# EAGLE schematic video-max3000a (EAGLE 5.11)
DRAWN_BY: Alexios; PROJECT_NAME: CFT Mini-Computer; REVISION: Rev J; SHEET_DESCRIPTION: Bus Connectors; SIMULATION_FILENAME: N/A; URL: http://www.bedroomlan.org/cft

## Sheet 1 of 2
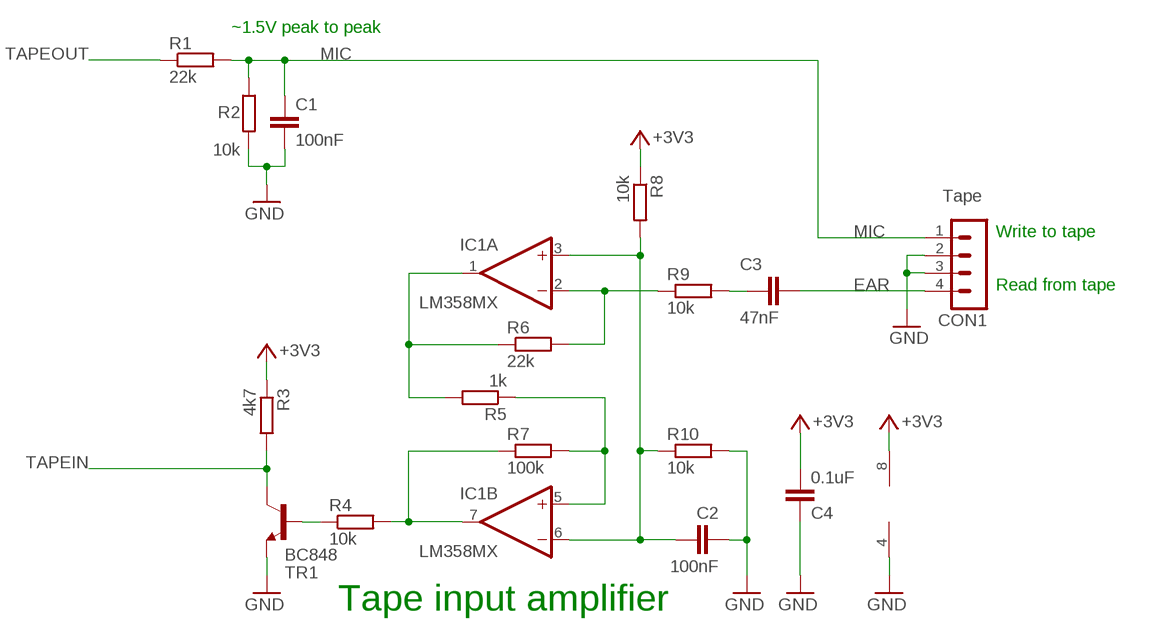
[diagram p0: schematic, sheet 1, part 1 of 3]
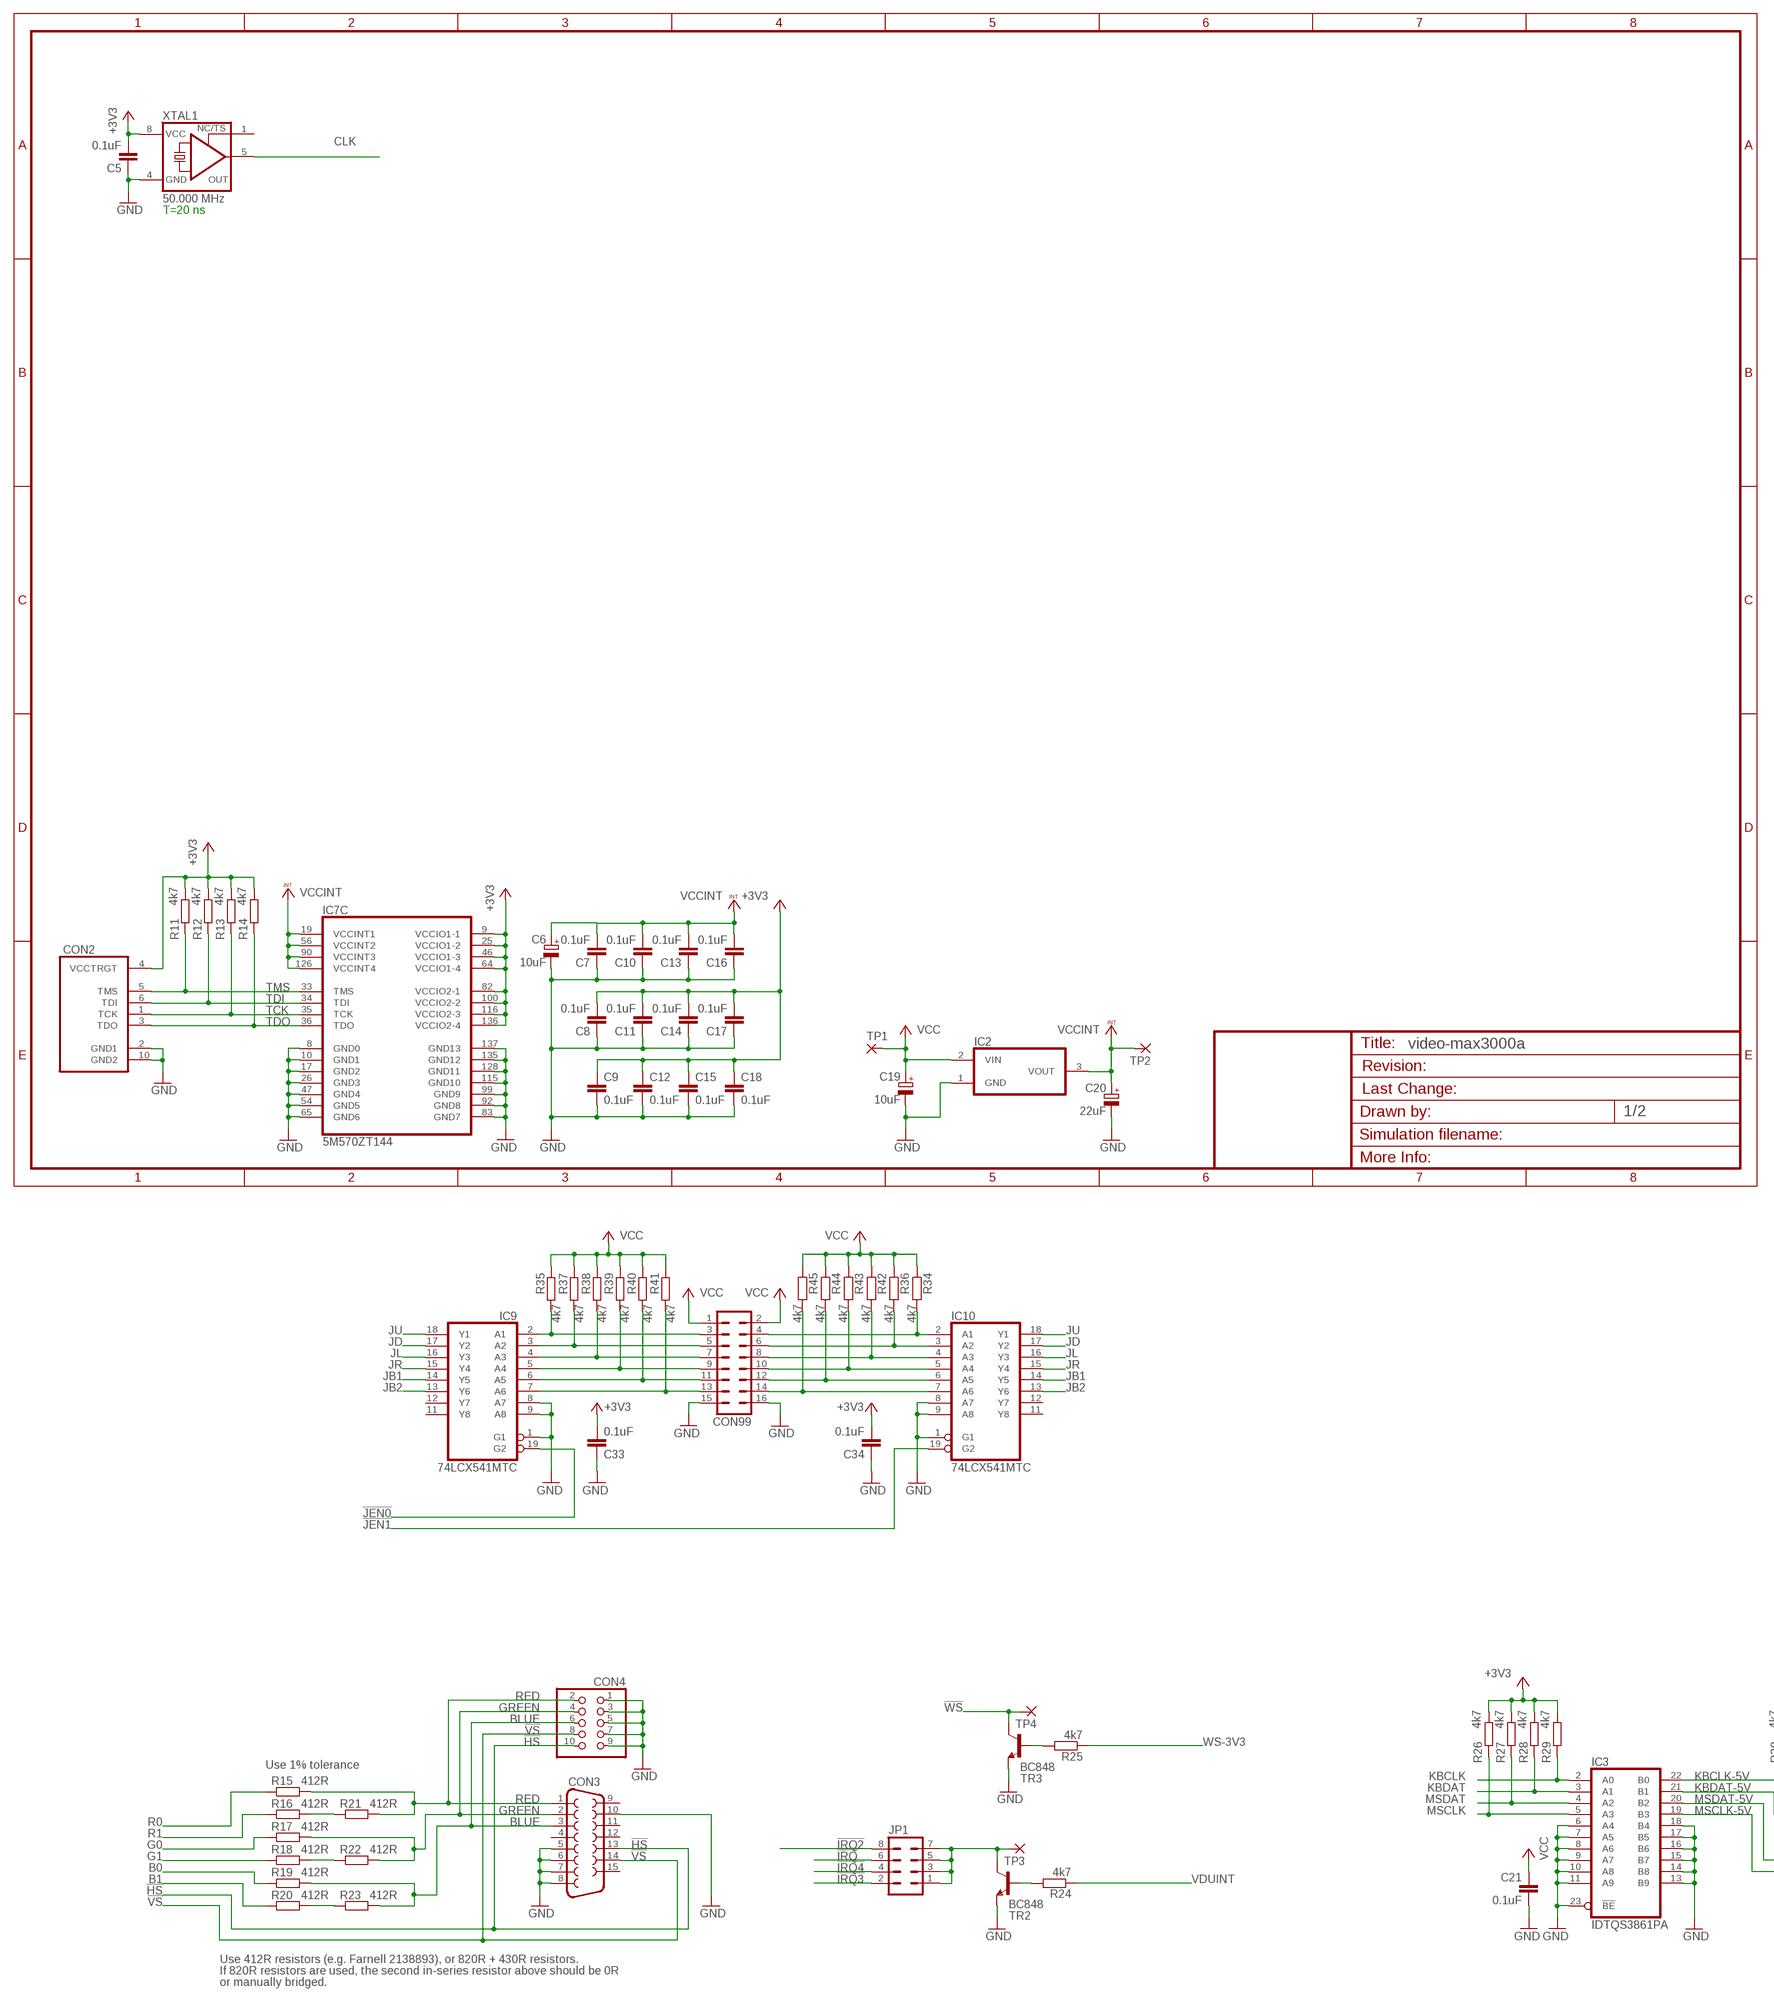
[diagram p1: schematic, sheet 1, part 2 of 3]
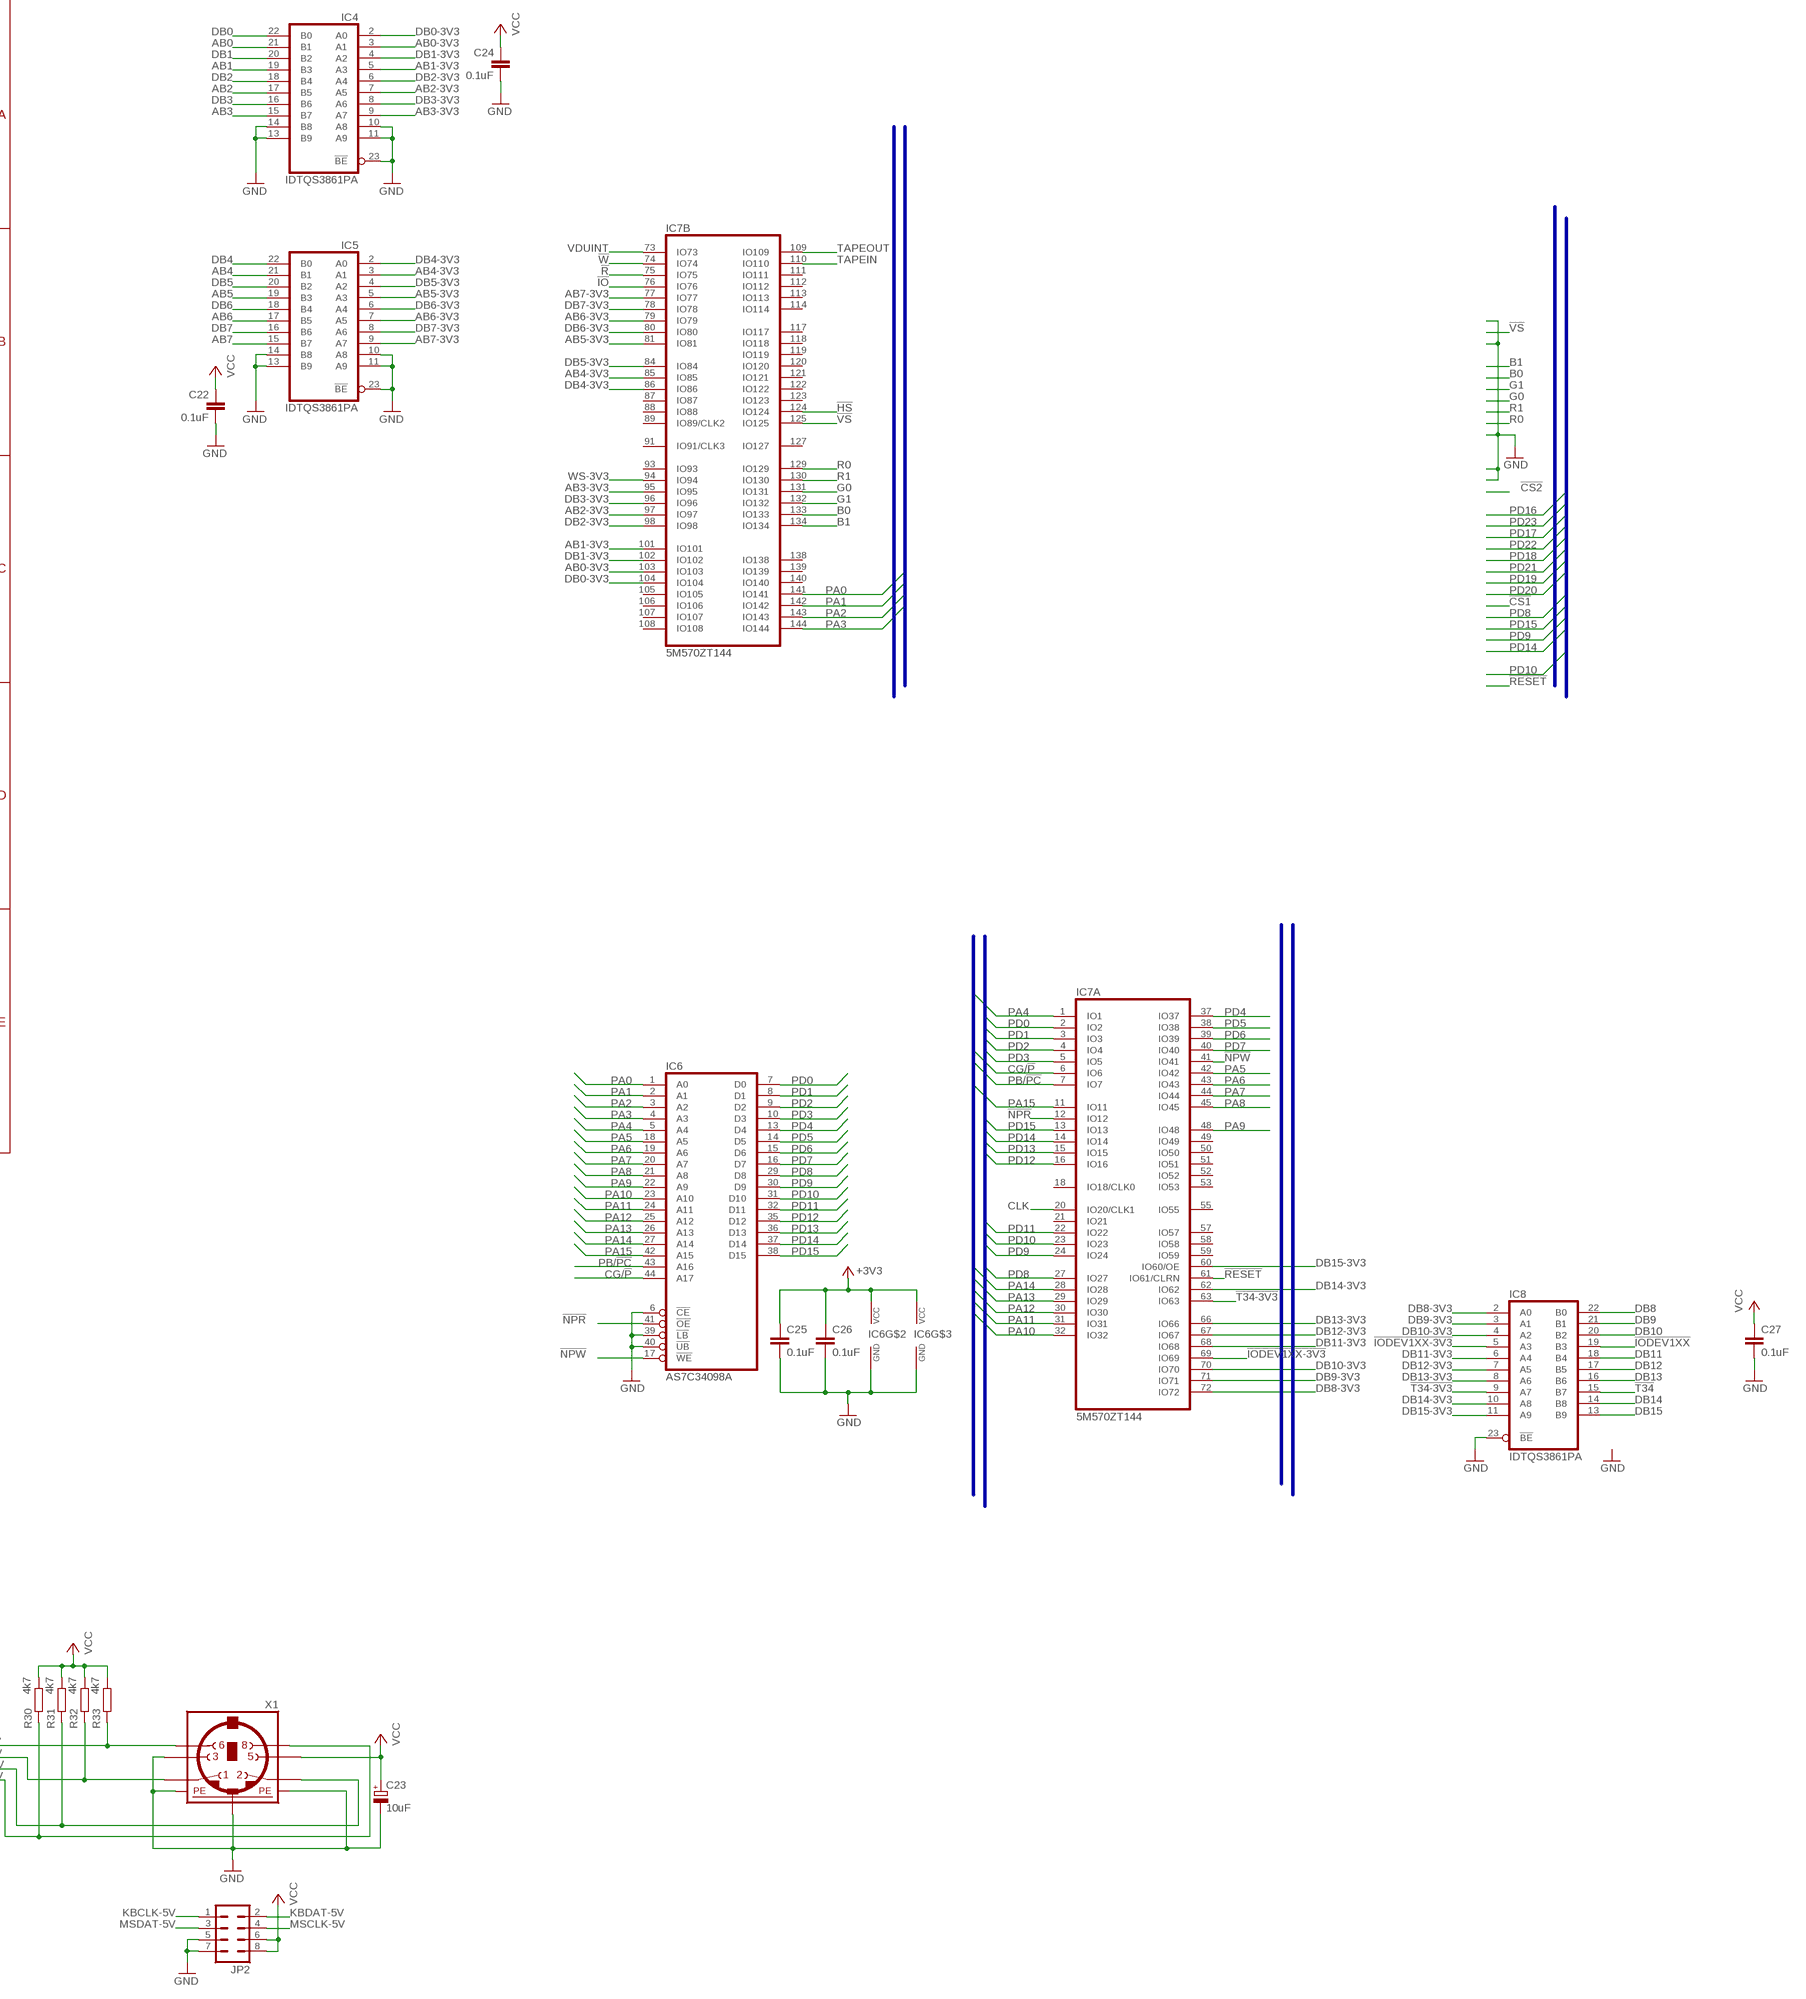
[diagram p2: schematic, sheet 1, part 3 of 3]

### Parts
C1  100nF  C-EUC0805K  [C0805K]
C2  100nF  C-EUC0805K  [C0805K]
C3  47nF  C-EUC0805K  [C0805K]
C4  0.1uF  C-EUC0805K  [C0805K]
C5  0.1uF  C-EUC0805K  [C0805K]
C6  10uF  CPOL-EUE2-5  [E2-5]
C7  0.1uF  C-EUC0805K  [C0805K]
C8  0.1uF  C-EUC0805K  [C0805K]
C9  0.1uF  C-EUC0805K  [C0805K]
C10  0.1uF  C-EUC0805K  [C0805K]
C11  0.1uF  C-EUC0805K  [C0805K]
C12  0.1uF  C-EUC0805K  [C0805K]
C13  0.1uF  C-EUC0805K  [C0805K]
C14  0.1uF  C-EUC0805K  [C0805K]
C15  0.1uF  C-EUC0805K  [C0805K]
C16  0.1uF  C-EUC0805K  [C0805K]
C17  0.1uF  C-EUC0805K  [C0805K]
C18  0.1uF  C-EUC0805K  [C0805K]
C19  10uF  CPOL-EUE2-5  [E2-5]
C20  22uF  CPOL-EUE2-5  [E2-5]
C21  0.1uF  C-EUC0805K  [C0805K]
C22  0.1uF  C-EUC0805K  [C0805K]
C23  10uF  CPOL-EUE2-5  [E2-5]
C24  0.1uF  C-EUC0805K  [C0805K]
C25  0.1uF  C-EUC0805K  [C0805K]
C26  0.1uF  C-EUC0805K  [C0805K]
C27  0.1uF  C-EUC0805K  [C0805K]
C33  0.1uF  C-EUC0805K  [C0805K]
C34  0.1uF  C-EUC0805K  [C0805K]
CON1  MA04-1  [MA04-1]
CON2  JTAG-ALTERA  [SHROUDED-HEADER-2X5-2.5MM]
CON3  F15HDH  [HDF15H]
CON4  PINHD-2X5  [2X05]
CON99  MA08-2  [MA08-2]
IC1  LM358MX  [SO08]
IC2  AP1117D18  [TO252]
IC3  IDTQS3861PA  [TSSOP24]
IC4  IDTQS3861PA  [TSSOP24]
IC5  IDTQS3861PA  [TSSOP24]
IC6  AS7C34098A  [SOJ44-4]
IC7  5M570ZT144  [TQFP144]
IC8  IDTQS3861PA  [TSSOP24]
IC9  74LCX541MTC  [TSSOP20]
IC10  74LCX541MTC  [TSSOP20]
JP1  MA04-2  [MA04-2]
JP2  MA04-2  [MA04-2]
R1  22k  R-EU_R0805W  [R0805W]
R2  10k  R-EU_R0805W  [R0805W]
R3  4k7  R-EU_R0805W  [R0805W]
R4  10k  R-EU_R0805W  [R0805W]
R5  1k  R-EU_R0805W  [R0805W]
R6  22k  R-EU_R0805W  [R0805W]
R7  100k  R-EU_R0805W  [R0805W]
R8  10k  R-EU_R0805W  [R0805W]
R9  10k  R-EU_R0805W  [R0805W]
R10  10k  R-EU_R0805W  [R0805W]
R11  4k7  R-EU_R0805W  [R0805W]
R12  4k7  R-EU_R0805W  [R0805W]
R13  4k7  R-EU_R0805W  [R0805W]
R14  4k7  R-EU_R0805W  [R0805W]
R15  412R  R-EU_R0805W  [R0805W]
R16  412R  R-EU_R0805W  [R0805W]
R17  412R  R-EU_R0805W  [R0805W]
R18  412R  R-EU_R0805W  [R0805W]
R19  412R  R-EU_R0805W  [R0805W]
R20  412R  R-EU_R0805W  [R0805W]
R21  412R  R-EU_R0805W  [R0805W]
R22  412R  R-EU_R0805W  [R0805W]
R23  412R  R-EU_R0805W  [R0805W]
R24  4k7  R-EU_R0805W  [R0805W]
R25  4k7  R-EU_R0805W  [R0805W]
R26  4k7  R-EU_R0805W  [R0805W]
R27  4k7  R-EU_R0805W  [R0805W]
R28  4k7  R-EU_R0805W  [R0805W]
R29  4k7  R-EU_R0805W  [R0805W]
R30  4k7  R-EU_R0805W  [R0805W]
R31  4k7  R-EU_R0805W  [R0805W]
R32  4k7  R-EU_R0805W  [R0805W]
R33  4k7  R-EU_R0805W  [R0805W]
R34  4k7  R-EU_R0805W  [R0805W]
R35  4k7  R-EU_R0805W  [R0805W]
R36  4k7  R-EU_R0805W  [R0805W]
R37  4k7  R-EU_R0805W  [R0805W]
R38  4k7  R-EU_R0805W  [R0805W]
R39  4k7  R-EU_R0805W  [R0805W]
R40  4k7  R-EU_R0805W  [R0805W]
R41  4k7  R-EU_R0805W  [R0805W]
R42  4k7  R-EU_R0805W  [R0805W]
R43  4k7  R-EU_R0805W  [R0805W]
R44  4k7  R-EU_R0805W  [R0805W]
R45  4k7  R-EU_R0805W  [R0805W]
TP1  2,54/0,8  [2,54/0,8]
TP2  2,54/0,8  [2,54/0,8]
TP3  2,54/0,8  [2,54/0,8]
TP4  2,54/0,8  [2,54/0,8]
TR1  BC848  [SOT23]
TR2  BC848  [SOT23]
TR3  BC848  [SOT23]
X1  MINI_DIN_6  [M_DIN6]
XTAL1  50.000 MHz  XO-8  [DIL08S]

### Nets
!HS: CON3.13 CON4.10 IC7.124(B:IO124)
!IO: IC7.76(B:IO76) ; also sheet 2
!IODEV1XX: IC8.19(B3) ; also sheet 2
!IODEV1XX-3V3: IC7.69(A:IO69) IC8.5(A3)
!IRQ: JP1.6 ; also sheet 2
!IRQ2: JP1.8 ; also sheet 2
!IRQ3: JP1.2 ; also sheet 2
!IRQ4: JP1.4 ; also sheet 2
!JEN0: IC9.19(G2)
!JEN1: IC10.19(G2)
!NPR: IC6.41(!OE) IC7.12(A:IO12)
!NPW: IC6.17(!WE) IC7.41(A:IO41)
!R: IC7.75(B:IO75) ; also sheet 2
!RESET: IC7.61(A:IO61/CLRN) ; also sheet 2
!T34: IC8.15(B7) ; also sheet 2
!T34-3V3: IC7.63(A:IO63) IC8.9(A7)
!VS: CON3.14 CON4.8 IC7.125(B:IO125)
!W: IC7.74(B:IO74) ; also sheet 2
!WS: TP4.1(P) TR3.3(C) ; also sheet 2
+3V3: C4.2 C5.2 C8.2 C9.1 C11.2 C12.1 C14.2 C15.1 C17.2 C18.1 C25.1 C26.1 C33.2 C34.2 CON2.4(VCCTRGT) IC1.8(P:V+) IC6.11(VCC) IC6.33(VCC) IC7.9(C:VCCIO1-1) IC7.25(C:VCCIO1-2) IC7.46(C:VCCIO1-3) IC7.64(C:VCCIO1-4) IC7.82(C:VCCIO2-1) IC7.100(C:VCCIO2-2) IC7.116(C:VCCIO2-3) IC7.136(C:VCCIO2-4) R3.1 R8.1 R11.2 R12.2 R13.2 R14.2 R26.2 R27.2 R28.2 R29.2 XTAL1.8(VCC) ; also sheet 2
AB0: IC4.21(B1) ; also sheet 2
AB0-3V3: IC4.3(A1) IC7.103(B:IO103)
AB1: IC4.19(B3) ; also sheet 2
AB1-3V3: IC4.5(A3) IC7.101(B:IO101)
AB2: IC4.17(B5) ; also sheet 2
AB2-3V3: IC4.7(A5) IC7.97(B:IO97)
AB3: IC4.15(B7) ; also sheet 2
AB3-3V3: IC4.9(A7) IC7.95(B:IO95)
AB4: IC5.21(B1) ; also sheet 2
AB4-3V3: IC5.3(A1) IC7.85(B:IO85)
AB5: IC5.19(B3) ; also sheet 2
AB5-3V3: IC5.5(A3) IC7.81(B:IO81)
AB6: IC5.17(B5) ; also sheet 2
AB6-3V3: IC5.7(A5) IC7.79(B:IO79)
AB7: IC5.15(B7) ; also sheet 2
AB7-3V3: IC5.9(A7) IC7.77(B:IO77)
B0: IC7.133(B:IO133) R19.1
B1: IC7.134(B:IO134) R20.1
BLUE [Analogue]: CON3.3 CON4.6 R19.2 R23.2
CG/!P!: IC6.44(A17) IC7.6(A:IO6)
CLK: IC7.20(A:IO20/CLK1) XTAL1.5(OUT)
DB0: IC4.22(B0) ; also sheet 2
DB0-3V3: IC4.2(A0) IC7.104(B:IO104)
DB1: IC4.20(B2) ; also sheet 2
DB1-3V3: IC4.4(A2) IC7.102(B:IO102)
DB2: IC4.18(B4) ; also sheet 2
DB2-3V3: IC4.6(A4) IC7.98(B:IO98)
DB3: IC4.16(B6) ; also sheet 2
DB3-3V3: IC4.8(A6) IC7.96(B:IO96)
DB4: IC5.22(B0) ; also sheet 2
DB4-3V3: IC5.2(A0) IC7.86(B:IO86)
DB5: IC5.20(B2) ; also sheet 2
DB5-3V3: IC5.4(A2) IC7.84(B:IO84)
DB6: IC5.18(B4) ; also sheet 2
DB6-3V3: IC5.6(A4) IC7.80(B:IO80)
DB7: IC5.16(B6) ; also sheet 2
DB7-3V3: IC5.8(A6) IC7.78(B:IO78)
DB8: IC8.22(B0) ; also sheet 2
DB8-3V3: IC7.72(A:IO72) IC8.2(A0)
DB9: IC8.21(B1) ; also sheet 2
DB9-3V3: IC7.71(A:IO71) IC8.3(A1)
DB10: IC8.20(B2) ; also sheet 2
DB10-3V3: IC7.70(A:IO70) IC8.4(A2)
DB11: IC8.18(B4) ; also sheet 2
DB11-3V3: IC7.68(A:IO68) IC8.6(A4)
DB12: IC8.17(B5) ; also sheet 2
DB12-3V3: IC7.67(A:IO67) IC8.7(A5)
DB13: IC8.16(B6) ; also sheet 2
DB13-3V3: IC7.66(A:IO66) IC8.8(A6)
DB14: IC8.14(B8) ; also sheet 2
DB14-3V3: IC7.62(A:IO62) IC8.10(A8)
DB15: IC8.13(B9) ; also sheet 2
DB15-3V3: IC7.60(A:IO60/OE) IC8.11(A9)
EAR: C3.2 CON1.4
G0: IC7.131(B:IO131) R17.1
G1: IC7.132(B:IO132) R18.1
GND: C1.2 C2.2 C4.1 C5.1 C6.- C7.1 C8.1 C9.2 C10.1 C11.1 C12.2 C13.1 C14.1 C15.2 C16.1 C17.1 C18.2 C19.- C20.- C21.2 C22.2 C23.- C24.2 C25.2 C26.2 C27.2 C33.1 C34.1 CON1.2 CON1.3 CON2.2(GND1) CON2.10(GND2) CON3.5 CON3.6 CON3.7 CON3.8 CON3.10 CON4.1 CON4.3 CON4.5 CON4.7 CON4.9 CON99.15 CON99.16 IC1.4(P:V-) IC2.1(GND) IC3.6(A4) IC3.7(A5) IC3.8(A6) IC3.9(A7) IC3.10(A8) IC3.11(A9) IC3.13(B9) IC3.14(B8) IC3.15(B7) IC3.16(B6) IC3.17(B5) IC3.18(B4) IC3.23(!BE) IC4.10(A8) IC4.11(A9) IC4.13(B9) IC4.14(B8) IC4.23(!BE) IC5.10(A8) IC5.11(A9) IC5.13(B9) IC5.14(B8) IC5.23(!BE) IC6.6(!CE) IC6.12(GND) IC6.34(GND) IC6.39(!LB) IC6.40(!UB) IC7.8(C:GND0) IC7.10(C:GND1) IC7.17(C:GND2) IC7.26(C:GND3) IC7.47(C:GND4) IC7.54(C:GND5) IC7.65(C:GND6) IC7.83(C:GND7) IC7.92(C:GND8) IC7.99(C:GND9) IC7.115(C:GND10) IC7.128(C:GND11) IC7.135(C:GND12) IC7.137(C:GND13) IC8.23(!BE) IC9.1(G1) IC9.8(A7) IC9.9(A8) IC10.1(G1) IC10.8(A7) IC10.9(A8) JP2.5 JP2.7 R2.2 R10.2 TR1.2(E) TR2.2(E) TR3.2(E) X1.3 X1.SH1(PE1) X1.SH2(PE2) X1.SH3(PE3) XTAL1.4(GND) ; also sheet 2
GREEN [Analogue]: CON3.2 CON4.4 R17.2 R22.2
JB1: IC9.14(Y5) IC10.14(Y5)
JB2: IC9.13(Y6) IC10.13(Y6)
JD: IC9.17(Y2) IC10.17(Y2)
JL: IC9.16(Y3) IC10.16(Y3)
JR: IC9.15(Y4) IC10.15(Y4)
JU: IC9.18(Y1) IC10.18(Y1)
KBCLK: IC3.2(A0) R29.1
KBCLK-5V: IC3.22(B0) JP2.1 R33.1 X1.6
KBDAT: IC3.3(A1) R28.1
KBDAT-5V: IC3.21(B1) JP2.2 R32.1 X1.1
MIC: C1.1 CON1.1 R1.2 R2.1
MSCLK: IC3.5(A3) R26.1
MSCLK-5V: IC3.19(B3) JP2.4 R30.1 X1.8
MSDAT: IC3.4(A2) R27.1
MSDAT-5V: IC3.20(B2) JP2.3 R31.1 X1.2
N$1: R16.2 R21.1
N$2: R18.2 R22.1
N$3: R20.2 R23.1
N$4: CON99.4 IC10.2(A1) R34.2
N$5: CON99.3 IC9.2(A1) R35.2
N$6: R25.2 TR3.1(B)
N$7: CON99.5 IC9.3(A2) R37.2
N$8: CON99.7 IC9.4(A3) R38.2
N$9: CON99.9 IC9.5(A4) R39.2
N$10: CON99.11 IC9.6(A5) R40.2
N$11: CON99.13 IC9.7(A6) R41.2
N$12: CON99.6 IC10.3(A2) R36.2
N$13: CON99.8 IC10.4(A3) R42.2
N$14: CON99.10 IC10.5(A4) R43.2
N$15: CON99.12 IC10.6(A5) R44.2
N$16: CON99.14 IC10.7(A6) R45.2
N$79: C3.1 R9.2
N$260: JP1.1 JP1.3 JP1.5 JP1.7 TP3.1(P) TR2.3(C)
N$507: IC1.2(A:-IN) R6.2 R9.1
N$527: IC1.5(B:+IN) R5.1 R7.2
N$769: IC1.7(B:OUT) R4.2 R7.1
N$770: R4.1 TR1.1(B)
N$771: C2.1 IC1.3(A:+IN) IC1.6(B:-IN) R8.2 R10.1
N$791: IC1.1(A:OUT) R5.2 R6.1
N$843: R24.2 TR2.1(B)
PA0: IC6.1(A0) IC7.141(B:IO141)
PA1: IC6.2(A1) IC7.142(B:IO142)
PA2: IC6.3(A2) IC7.143(B:IO143)
PA3: IC6.4(A3) IC7.144(B:IO144)
PA4: IC6.5(A4) IC7.1(A:IO1)
PA5: IC6.18(A5) IC7.42(A:IO42)
PA6: IC6.19(A6) IC7.43(A:IO43)
PA7: IC6.20(A7) IC7.44(A:IO44)
PA8: IC6.21(A8) IC7.45(A:IO45)
PA9: IC6.22(A9) IC7.48(A:IO48)
PA10: IC6.23(A10) IC7.32(A:IO32)
PA11: IC6.24(A11) IC7.31(A:IO31)
PA12: IC6.25(A12) IC7.30(A:IO30)
PA13: IC6.26(A13) IC7.29(A:IO29)
PA14: IC6.27(A14) IC7.28(A:IO28)
PA15: IC6.42(A15) IC7.11(A:IO11)
PB/!PC!: IC6.43(A16) IC7.7(A:IO7)
PD0: IC6.7(D0) IC7.2(A:IO2)
PD1: IC6.8(D1) IC7.3(A:IO3)
PD2: IC6.9(D2) IC7.4(A:IO4)
PD3: IC6.10(D3) IC7.5(A:IO5)
PD4: IC6.13(D4) IC7.37(A:IO37)
PD5: IC6.14(D5) IC7.38(A:IO38)
PD6: IC6.15(D6) IC7.39(A:IO39)
PD7: IC6.16(D7) IC7.40(A:IO40)
PD8: IC6.29(D8) IC7.27(A:IO27)
PD9: IC6.30(D9) IC7.24(A:IO24)
PD10: IC6.31(D10) IC7.23(A:IO23)
PD11: IC6.32(D11) IC7.22(A:IO22)
PD12: IC6.35(D12) IC7.16(A:IO16)
PD13: IC6.36(D13) IC7.15(A:IO15)
PD14: IC6.37(D14) IC7.14(A:IO14)
PD15: IC6.38(D15) IC7.13(A:IO13)
R0: IC7.129(B:IO129) R15.1
R1: IC7.130(B:IO130) R16.1
RED [Analogue]: CON3.1 CON4.2 R15.2 R21.2
TAPEIN: IC7.110(B:IO110) R3.2 TR1.3(C)
TAPEOUT: IC7.109(B:IO109) R1.1
TCK: CON2.1(TCK) IC7.35(C:TCK) R13.1
TDI: CON2.6(TDI) IC7.34(C:TDI) R12.1
TDO: CON2.3(TDO) IC7.36(C:TDO) R14.1
TMS: CON2.5(TMS) IC7.33(C:TMS) R11.1
VCC: C19.+ C21.1 C22.1 C23.+ C24.1 C27.1 CON99.1 CON99.2 IC2.2(VIN) JP2.6 JP2.8 R30.2 R31.2 R32.2 R33.2 R34.1 R35.1 R36.1 R37.1 R38.1 R39.1 R40.1 R41.1 R42.1 R43.1 R44.1 R45.1 TP1.1(P) X1.5 ; also sheet 2
VCCINT: C6.+ C7.2 C10.2 C13.2 C16.2 C20.+ IC2.3(VOUT) IC7.19(C:VCCINT1) IC7.56(C:VCCINT2) IC7.90(C:VCCINT3) IC7.126(C:VCCINT4) TP2.1(P)
VDUINT: IC7.73(B:IO73) R24.1
WS-3V3: IC7.94(B:IO94) R25.1
Unconnected: CON3.4 CON3.9 CON3.11 CON3.12 CON3.15 IC7.18(A:IO18/CLK0) IC7.21(A:IO21) IC7.49(A:IO49) IC7.50(A:IO50) IC7.51(A:IO51) IC7.52(A:IO52) IC7.53(A:IO53) IC7.55(A:IO55) IC7.57(A:IO57) IC7.58(A:IO58) IC7.59(A:IO59) IC7.87(B:IO87) IC7.88(B:IO88) IC7.89(B:IO89/CLK2) IC7.91(B:IO91/CLK3) IC7.93(B:IO93) IC7.105(B:IO105) IC7.106(B:IO106) IC7.107(B:IO107) IC7.108(B:IO108) IC7.111(B:IO111) IC7.112(B:IO112) IC7.113(B:IO113) IC7.114(B:IO114) IC7.117(B:IO117) IC7.118(B:IO118) IC7.119(B:IO119) IC7.120(B:IO120) IC7.121(B:IO121) IC7.122(B:IO122) IC7.123(B:IO123) IC7.127(B:IO127) IC7.138(B:IO138) IC7.139(B:IO139) IC7.140(B:IO140) IC9.11(Y8) IC9.12(Y7) IC10.11(Y8) IC10.12(Y7) XTAL1.1(TS)

### Buses
PD[0..23]
PA[0..15],PB/!PC!,CG/!P!

### Notes on the sheet
- T=20 ns
- ~1.5V peak to peak
- Tape
- Write to tape
- Use 1% tolerance
- Read from tape
- Use 412R resistors (e.g. Farnell 2138893), or 820R + 430R resistors.
- If 820R resistors are used, the second in-series resistor above should be 0R
- Tape input amplifier | or manually bridged.

## Sheet 2 of 2
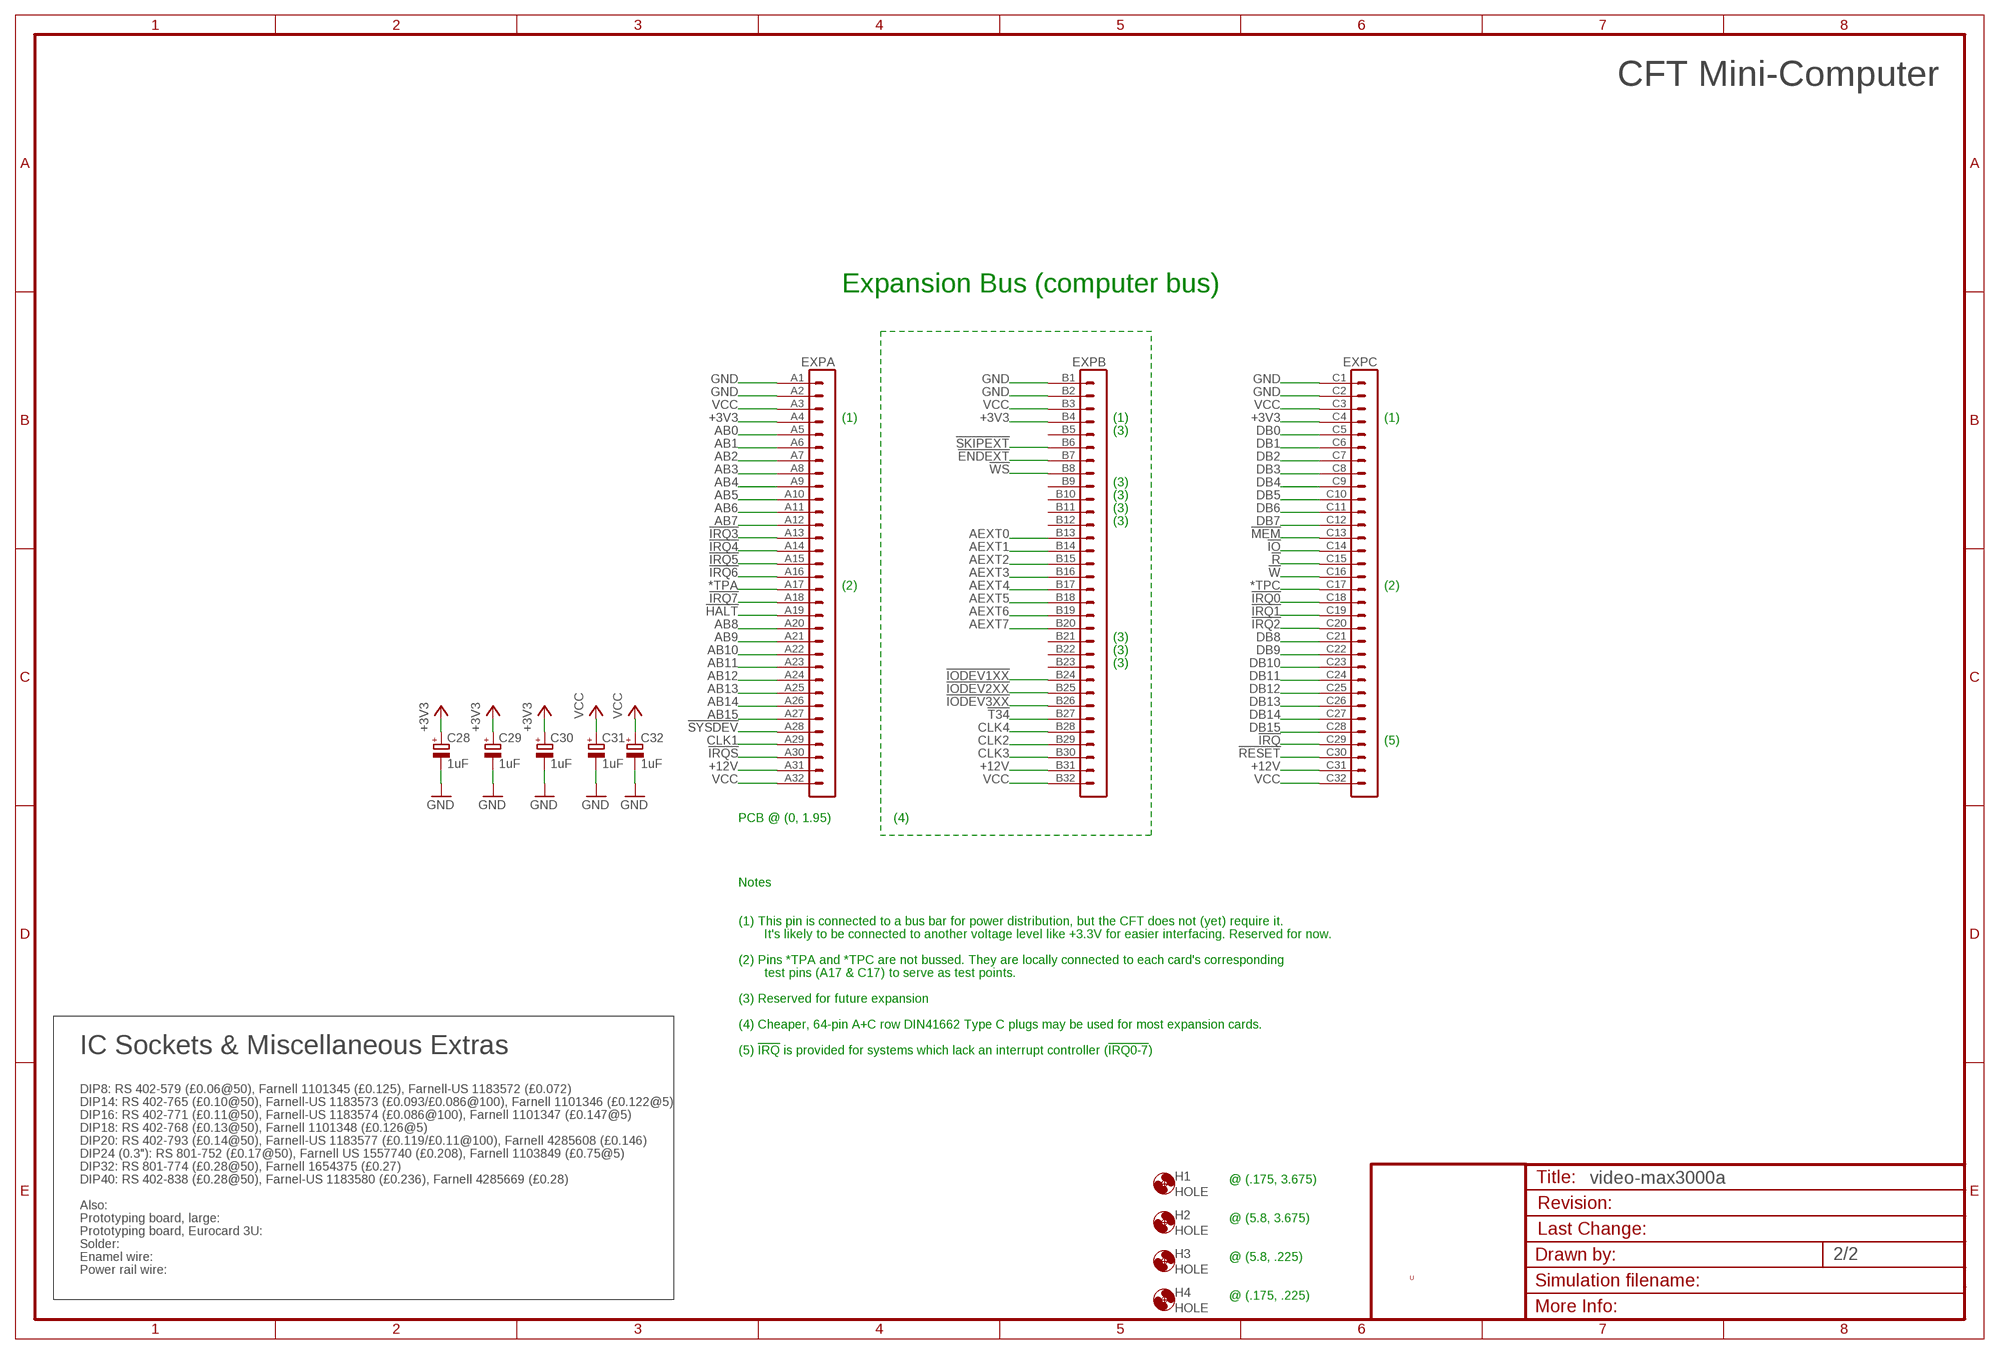
[diagram p3: schematic, sheet 2]

### Parts
C28  1uF  CPOL-EUE2.5-5  [E2,5-5]
C29  1uF  CPOL-EUE2.5-5  [E2,5-5]
C30  1uF  CPOL-EUE2.5-5  [E2,5-5]
C31  1uF  CPOL-EUE2.5-5  [E2,5-5]
C32  1uF  CPOL-EUE2.5-5  [E2,5-5]
EXP  VG96-3K  [VG96K]
H1  HOLE  [STANDOFF_28_60]
H2  HOLE  [STANDOFF_28_60]
H3  HOLE  [STANDOFF_28_60]
H4  HOLE  [STANDOFF_28_60]

### Nets
!ENDEXT: EXP.B7
!HALT: EXP.A19
!IO: EXP.C14 ; also sheet 1
!IODEV1XX: EXP.B24 ; also sheet 1
!IODEV2XX: EXP.B25
!IODEV3XX: EXP.B26
!IRQ: EXP.C29 ; also sheet 1
!IRQ0: EXP.C18
!IRQ1: EXP.C19
!IRQ2: EXP.C20 ; also sheet 1
!IRQ3: EXP.A13 ; also sheet 1
!IRQ4: EXP.A14 ; also sheet 1
!IRQ5: EXP.A15
!IRQ6: EXP.A16
!IRQ7: EXP.A18
!IRQS: EXP.A30
!MEM: EXP.C13
!R: EXP.C15 ; also sheet 1
!RESET: EXP.C30 ; also sheet 1
!SKIPEXT: EXP.B6
!SYSDEV: EXP.A28
!T34: EXP.B27 ; also sheet 1
!W: EXP.C16 ; also sheet 1
!WS: EXP.B8 ; also sheet 1
*TPA: EXP.A17
*TPC: EXP.C17
+3V3: C28.+ C29.+ C30.+ EXP.A4 EXP.B4 EXP.C4 ; also sheet 1
+12V [LED power]: EXP.A31 EXP.B31 EXP.C31
AB0: EXP.A5 ; also sheet 1
AB1: EXP.A6 ; also sheet 1
AB2: EXP.A7 ; also sheet 1
AB3: EXP.A8 ; also sheet 1
AB4: EXP.A9 ; also sheet 1
AB5: EXP.A10 ; also sheet 1
AB6: EXP.A11 ; also sheet 1
AB7: EXP.A12 ; also sheet 1
AB8: EXP.A20
AB9: EXP.A21
AB10: EXP.A22
AB11: EXP.A23
AB12: EXP.A24
AB13: EXP.A25
AB14: EXP.A26
AB15: EXP.A27
AEXT0: EXP.B13
AEXT1: EXP.B14
AEXT2: EXP.B15
AEXT3: EXP.B16
AEXT4: EXP.B17
AEXT5: EXP.B18
AEXT6: EXP.B19
AEXT7: EXP.B20
CLK1: EXP.A29
CLK2: EXP.B29
CLK3: EXP.B30
CLK4: EXP.B28
DB0: EXP.C5 ; also sheet 1
DB1: EXP.C6 ; also sheet 1
DB2: EXP.C7 ; also sheet 1
DB3: EXP.C8 ; also sheet 1
DB4: EXP.C9 ; also sheet 1
DB5: EXP.C10 ; also sheet 1
DB6: EXP.C11 ; also sheet 1
DB7: EXP.C12 ; also sheet 1
DB8: EXP.C21 ; also sheet 1
DB9: EXP.C22 ; also sheet 1
DB10: EXP.C23 ; also sheet 1
DB11: EXP.C24 ; also sheet 1
DB12: EXP.C25 ; also sheet 1
DB13: EXP.C26 ; also sheet 1
DB14: EXP.C27 ; also sheet 1
DB15: EXP.C28 ; also sheet 1
GND: C28.- C29.- C30.- C31.- C32.- EXP.A1 EXP.A2 EXP.B1 EXP.B2 EXP.C1 EXP.C2 ; also sheet 1
VCC: C31.+ C32.+ EXP.A3 EXP.A32 EXP.B3 EXP.B32 EXP.C3 EXP.C32 ; also sheet 1
Unconnected: EXP.B5 EXP.B9 EXP.B10 EXP.B11 EXP.B12 EXP.B21 EXP.B22 EXP.B23

### Notes on the sheet
- CFT Mini-Computer
- Expansion Bus (computer bus)
- (1) | (1) | (1)
- (3)
- (3)
- (3)
- (3)
- (3)
- (2) | (2)
- (3)
- (3)
- (3)
- (5)
- PCB @ (0, 1.95) | (4)
- Notes
- (1) This pin is connected to a bus bar for power distribution, but the CFT does not (yet) require it.
- It's likely to be connected to another voltage level like +3.3V for easier interfacing. Reserved for now.
- (2) Pins *TPA and *TPC are not bussed. They are locally connected to each card's corresponding
- test pins (A17 & C17) to serve as test points.
- (3) Reserved for future expansion
- (4) Cheaper, 64-pin A+C row DIN41662 Type C plugs may be used for most expansion cards.
- IC Sockets & Miscellaneous Extras | (5) !IRQ! is provided for systems which lack an interrupt controller (!IRQ0-7!)
- DIP8: RS 402-579 (£0.06@50), Farnell 1101345 (£0.125), Farnell-US 1183572 (£0.072)
- DIP14: RS 402-765 (£0.10@50), Farnell-US 1183573 (£0.093/£0.086@100), Farnell 1101346 (£0.122@5)
- DIP16: RS 402-771 (£0.11@50), Farnell-US 1183574 (£0.086@100), Farnell 1101347 (£0.147@5)
- DIP18: RS 402-768 (£0.13@50), Farnell 1101348 (£0.126@5)
- DIP20: RS 402-793 (£0.14@50), Farnell-US 1183577 (£0.119/£0.11@100), Farnell 4285608 (£0.146)
- DIP24 (0.3"): RS 801-752 (£0.17@50), Farnell US 1557740 (£0.208), Farnell 1103849 (£0.75@5)
- DIP32: RS 801-774 (£0.28@50), Farnell 1654375 (£0.27)
- DIP40: RS 402-838 (£0.28@50), Farnel-US 1183580 (£0.236), Farnell 4285669 (£0.28) | @ (.175, 3.675)
- Also:
- Prototyping board, large: | @ (5.8, 3.675)
- Prototyping board, Eurocard 3U:
- Solder:
- Enamel wire: | @ (5.8, .225)
- Power rail wire:
- U
- @ (.175, .225)

## Power pins joined to a net without a drawn wire
GND: IC3.12(GND) IC4.12(GND) IC5.12(GND) IC8.12(GND) IC9.10(GND) IC10.10(GND)
VCC: IC3.24(VCC) IC4.24(VCC) IC5.24(VCC) IC8.24(VCC) IC9.20(VCC) IC10.20(VCC)

## Library data of the parts
C1-C5 C7-C18 C21 C22 C24-C27 C33 C34 = rcl:C-EU: CAPACITOR, European symbol
C6 C19 C20 C23 C28-C32 = rcl:CPOL-EU: POLARIZED CAPACITOR, European symbol
CON1 = con-lstb:MA04-1: PIN HEADER; OC_FARNELL: unknown; OC_NEWARK: unknown
CON2 = alexios:JTAG-ALTERA
CON3 = con-subd:F15: SUB-D; OC_FARNELL: unknown; OC_NEWARK: unknown
CON4 = pinhead:PINHD-2X5: PIN HEADER
CON99 = con-lstb:MA08-2: PIN HEADER; OC_FARNELL: unknown; OC_NEWARK: unknown
EXP = alexios-19inch:VG96-3: PCB EUROCARD, 96-pin type C/ABC, 2.54 mm
H1-H4 = alexios:HOLE: Hole for a standoff or mount. Hole diameter: 3.3mm. External Diameter: 6mm.
IC1 = linear:LM358: OP AMP also LM158; LM258; LM2904 Source: http://cache.national.com/ds/LM/LM158.pdf
IC2 = alexios:AP1117: 1A LOW DROPOUT (LDO) POSITIVE FIXED-MODE REGULATOR http://www.farnell.com/datasheets/608751.pdf
IC3-IC5 IC8 = alexios:IDTQS3861: IDT QuickSwitch® High Speed CMOS Bus Switch with Flow-Through Pinout http://www.idt.com/products/memory-logic/bus-switch/50v-quickswitch/qs3861-high-speed-cmos-10-bit-bus-switch-flow-thru-pinout
IC6 = alexios:AS7C34098A: 3.3 V 256 K × 16 CMOS SRAM Datasheet: http://www.farnell.com/datasheets/32806.pdf Farnell: 1562919 <http://export.farnell.com/alliance-memory/as7c34098a-12jin/sram-4mb-3v-12ns-256kx16-soj44/dp/1562919> Features ? Pin compatible with AS7C34098 ? Industrial and commercial temperature ? Organization: 262,144 words × 16 bits ? Center power and ground pins ? High speed - 10/12/15/20 ns address access time - 4/5/6/7 ns output enable access time ? Low power consumption: ACTIVE - 650 mW /max @ 10 ns ? Low power consumption: STANDBY - 28.8 mW /max CMOS ? Individual byte read/write controls ? Easy memory expansion with CE, OE inputs ? TTL- and CMOS-compatible, three-state I/O ? 44-pin JEDEC standard packages - 400-mil SOJ - TSOP 2 ? ESD protection ? 2000 volts ? Latch-up current ? 200 mA
IC7 = alexios:5M570Z: Altera MAX V CPLD, 570 Logic Elements
IC9 IC10 = alexios:74*541: Octal BUFFER and LINE DRIVER, 3-state
JP1 JP2 = con-lstb:MA04-2: PIN HEADER; OC_FARNELL: unknown; OC_NEWARK: unknown
R1 R2 R4-R14 R26-R33 = resistor:R-EU_: RESISTOR, European symbol
R3 R15-R25 R34-R45 = rcl:R-EU_: RESISTOR, European symbol
TP1-TP4 = wirepad:2,54/0,8: THROUGH-HOLE PAD
TR1-TR3 = transistor-neu-to92:BC848: NPN TRANSISTOR
X1 = mini_din:MINI_DIN_6
XTAL1 = crystal:XO-: CRYSTAL; OC_FARNELL: unknown; OC_NEWARK: unknown

## Net classes
0 default: width 0.254 mm, clearance 0.203 mm
1 low power: width 1.27 mm, clearance 0.254 mm
2 LED power: width 1.93 mm, clearance 0.254 mm
3 3.3V power: width 0.61 mm, clearance 0.203 mm
4 Analogue: width 0.406 mm, clearance 0.305 mm